# Altium schematic sheet USB.SchDoc
size A4
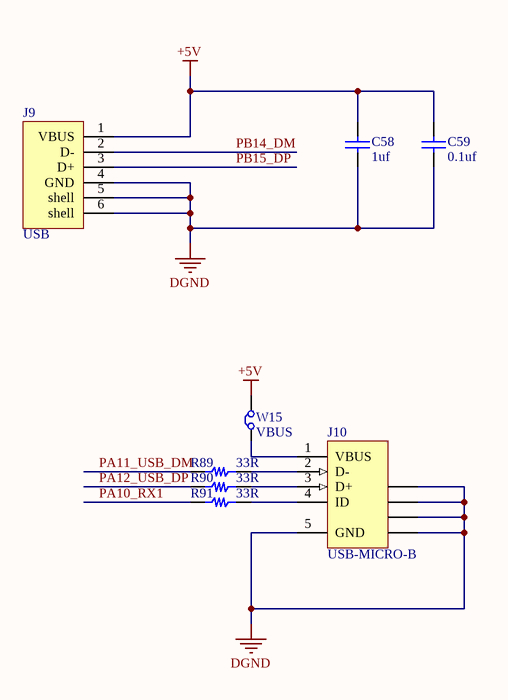
[diagram p0: USB.SchDoc]

## Parts
C58  1uf  [0805C]
C59  0.1uf  [0805C]
J9  USB  [USB-A]
J10  USB-MICRO-B  [USB-MINI-B]
R89  33R  [0805_small]
R90  33R  [0805_small]
R91  33R  [0805_small]
W15  VBUS  [sip2-2.54mm]

## Nets
+5V: C58.1 C59.1 J9.1(VBUS) W15.2(C2)
DGND: C58.2 C59.2 J9.4(GND) J9.5(shell) J9.6(shell) J10.5(GND) J10.6(SHLD) J10.7(SHLD) J10.8(SHLD) J10.9(SHLD)
PA10_RX1: R91.2
PA11_USB_DM: R89.2
PA12_USB_DP: R90.2
PB14_DM: J9.2(D-)
PB15_DP: J9.3(D+)
NetJ10_1: J10.1(VBUS) W15.1(C1)
NetJ10_2: J10.2(D-) R89.1
NetJ10_3: J10.3(D+) R90.1
NetJ10_4: J10.4(ID) R91.1

## Library data of the parts
C58 C59 = Cap: 贴片电容; Value: 100pF; Published: 8-Jun-2000; LatestRevisionDate: 17-Jul-2002; LatestRevisionNote: Re-released for DXP Platform.; PackageReference: RAD-0.3; Publisher: Altium Limited
R89-R91 = Res: 电阻; Value: 230k; Published: 24-Mar-1999; LatestRevisionDate: 29-May-2009; LatestRevisionNote: IPC-7351 Footprint Added.; PackageVersion: Mar-2003; PackageReference: 6-0805; Publisher: Altium Limited; PackageDescription: Chip Resistor 0805 Case Size; Code_IPC: RESC2012
W15 = Jumper: Jumper Wire; Published: 24-Mar-1999; LatestRevisionDate: 17-Jul-2002; LatestRevisionNote: Re-released for DXP Platform.; PackageReference: RAD-0.2; Publisher: Altium Limited; PackageDescription: Radial Cap, Thru-Hole; 2 Leads; 0.2 in Pin Spacing